# EAGLE schematic sram_v2 (EAGLE 6.5.0)
SRAM
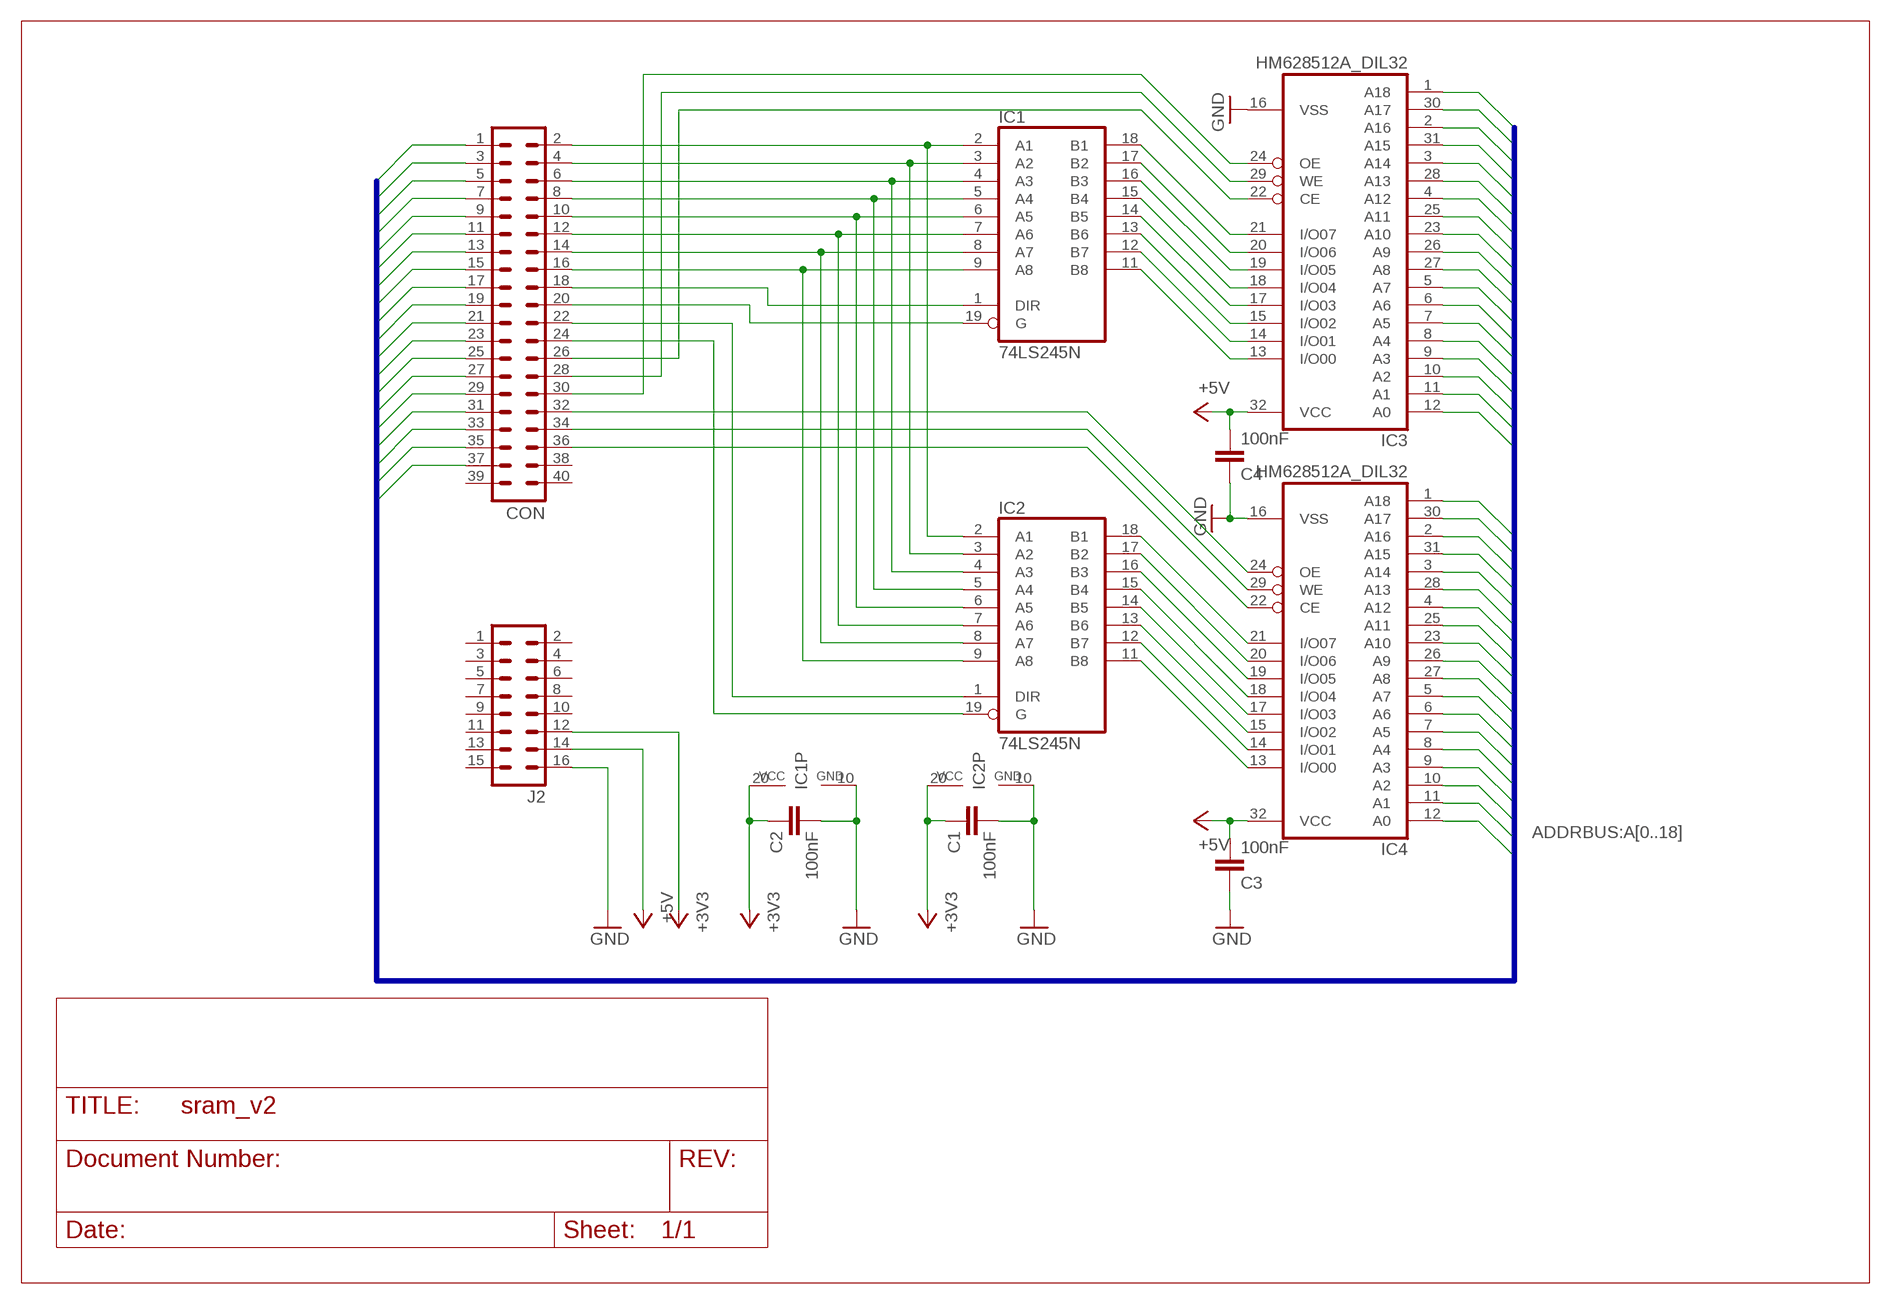
[diagram p0: schematic, sheet 1]

## Parts
C1  100nF  C-EU050-030X075  [C050-030X075]
C2  100nF  C-EU050-030X075  [C050-030X075]
C3  100nF  C-EU050-030X075  [C050-030X075]
C4  100nF  C-EU050-030X075  [C050-030X075]
CON  ML40  [ML40]
IC1  74LS245N  [DIL20]
IC2  74LS245N  [DIL20]
IC3  HM628512A_DIL32  [DIL32]
IC4  HM628512A_DIL32  [DIL32]
J2  ML16  [ML16]

## Nets
+3V3: C1.1 C2.1 IC1.20(VCC) IC2.20(VCC) J2.12
+5V: C3.2 C4.2 IC3.32(VCC) IC4.32(VCC) J2.14
A0: CON.1 IC3.12(A0) IC4.12(A0)
A1: CON.3 IC3.11(A1) IC4.11(A1)
A2: CON.5 IC3.10(A2) IC4.10(A2)
A3: CON.7 IC3.9(A3) IC4.9(A3)
A4: CON.9 IC3.8(A4) IC4.8(A4)
A5: CON.11 IC3.7(A5) IC4.7(A5)
A6: CON.13 IC3.6(A6) IC4.6(A6)
A7: CON.15 IC3.5(A7) IC4.5(A7)
A8: CON.17 IC3.27(A8) IC4.27(A8)
A9: CON.19 IC3.26(A9) IC4.26(A9)
A10: CON.21 IC3.23(A10) IC4.23(A10)
A11: CON.23 IC3.25(A11) IC4.25(A11)
A12: CON.25 IC3.4(A12) IC4.4(A12)
A13: CON.27 IC3.28(A13) IC4.28(A13)
A14: CON.29 IC3.3(A14) IC4.3(A14)
A15: CON.31 IC3.31(A15) IC4.31(A15)
A16: CON.33 IC3.2(A16) IC4.2(A16)
A17: CON.35 IC3.30(A17) IC4.30(A17)
A18: CON.37 IC3.1(A18) IC4.1(A18)
BUS0_CE: CON.20 IC1.19(G)
BUS1_CE: CON.24 IC2.19(G)
BUS1_DIR: CON.22 IC2.1(DIR)
D0: CON.2 IC1.2(A1) IC2.2(A1)
D1: CON.4 IC1.3(A2) IC2.3(A2)
D2: CON.6 IC1.4(A3) IC2.4(A3)
D3: CON.8 IC1.5(A4) IC2.5(A4)
D4: CON.10 IC1.6(A5) IC2.6(A5)
D5: CON.12 IC1.7(A6) IC2.7(A6)
D6: CON.14 IC1.8(A7) IC2.8(A7)
D7: CON.16 IC1.9(A8) IC2.9(A8)
GND: C1.2 C2.2 C3.1 C4.1 IC1.10(GND) IC2.10(GND) IC3.16(VSS) IC4.16(VSS) J2.16
N$1: IC1.18(B1) IC3.21(I/O07)
N$2: IC1.17(B2) IC3.20(I/O06)
N$3: IC1.16(B3) IC3.19(I/O05)
N$4: IC1.15(B4) IC3.18(I/O04)
N$5: IC1.14(B5) IC3.17(I/O03)
N$6: IC1.13(B6) IC3.15(I/O02)
N$7: IC1.12(B7) IC3.14(I/O01)
N$8: IC1.11(B8) IC3.13(I/O00)
N$9: IC2.18(B1) IC4.21(I/O07)
N$10: IC2.17(B2) IC4.20(I/O06)
N$11: IC2.16(B3) IC4.19(I/O05)
N$12: IC2.15(B4) IC4.18(I/O04)
N$13: IC2.14(B5) IC4.17(I/O03)
N$14: IC2.13(B6) IC4.15(I/O02)
N$15: IC2.12(B7) IC4.14(I/O01)
N$16: IC2.11(B8) IC4.13(I/O00)
N$25: CON.32 IC4.24(OE)
N$26: CON.34 IC4.29(WE)
N$27: CON.36 IC4.22(CE)
N$28: CON.18 IC1.1(DIR)
N$86: CON.26 IC3.22(CE)
N$87: CON.28 IC3.29(WE)
N$88: CON.30 IC3.24(OE)
Unconnected: CON.38 CON.39 CON.40 J2.1 J2.2 J2.3 J2.4 J2.5 J2.6 J2.7 J2.8 J2.9 J2.10 J2.11 J2.13 J2.15

## Buses
ADDRBUS:A[0..18]

## Library data of the parts
C1-C4 = rcl:C-EU: CAPACITOR, European symbol
CON = con-harting-ml:ML40: HARTING; OC_FARNELL: unknown; OC_NEWARK: unknown
IC1 IC2 = 74xx-eu:74*245: Octal BUS TRANSCEIVER, 3-state
IC3 IC4 = hitachi_sram_hm628512a-series_rev1:HM628512A_DIL32: 4M SRAM 512kword x 8bit
J2 = con-harting-ml:ML16: HARTING; OC_FARNELL: unknown; OC_NEWARK: unknown